# EAGLE design Spresense_PLC _Rev1-02 (EAGLE 9.6.2)
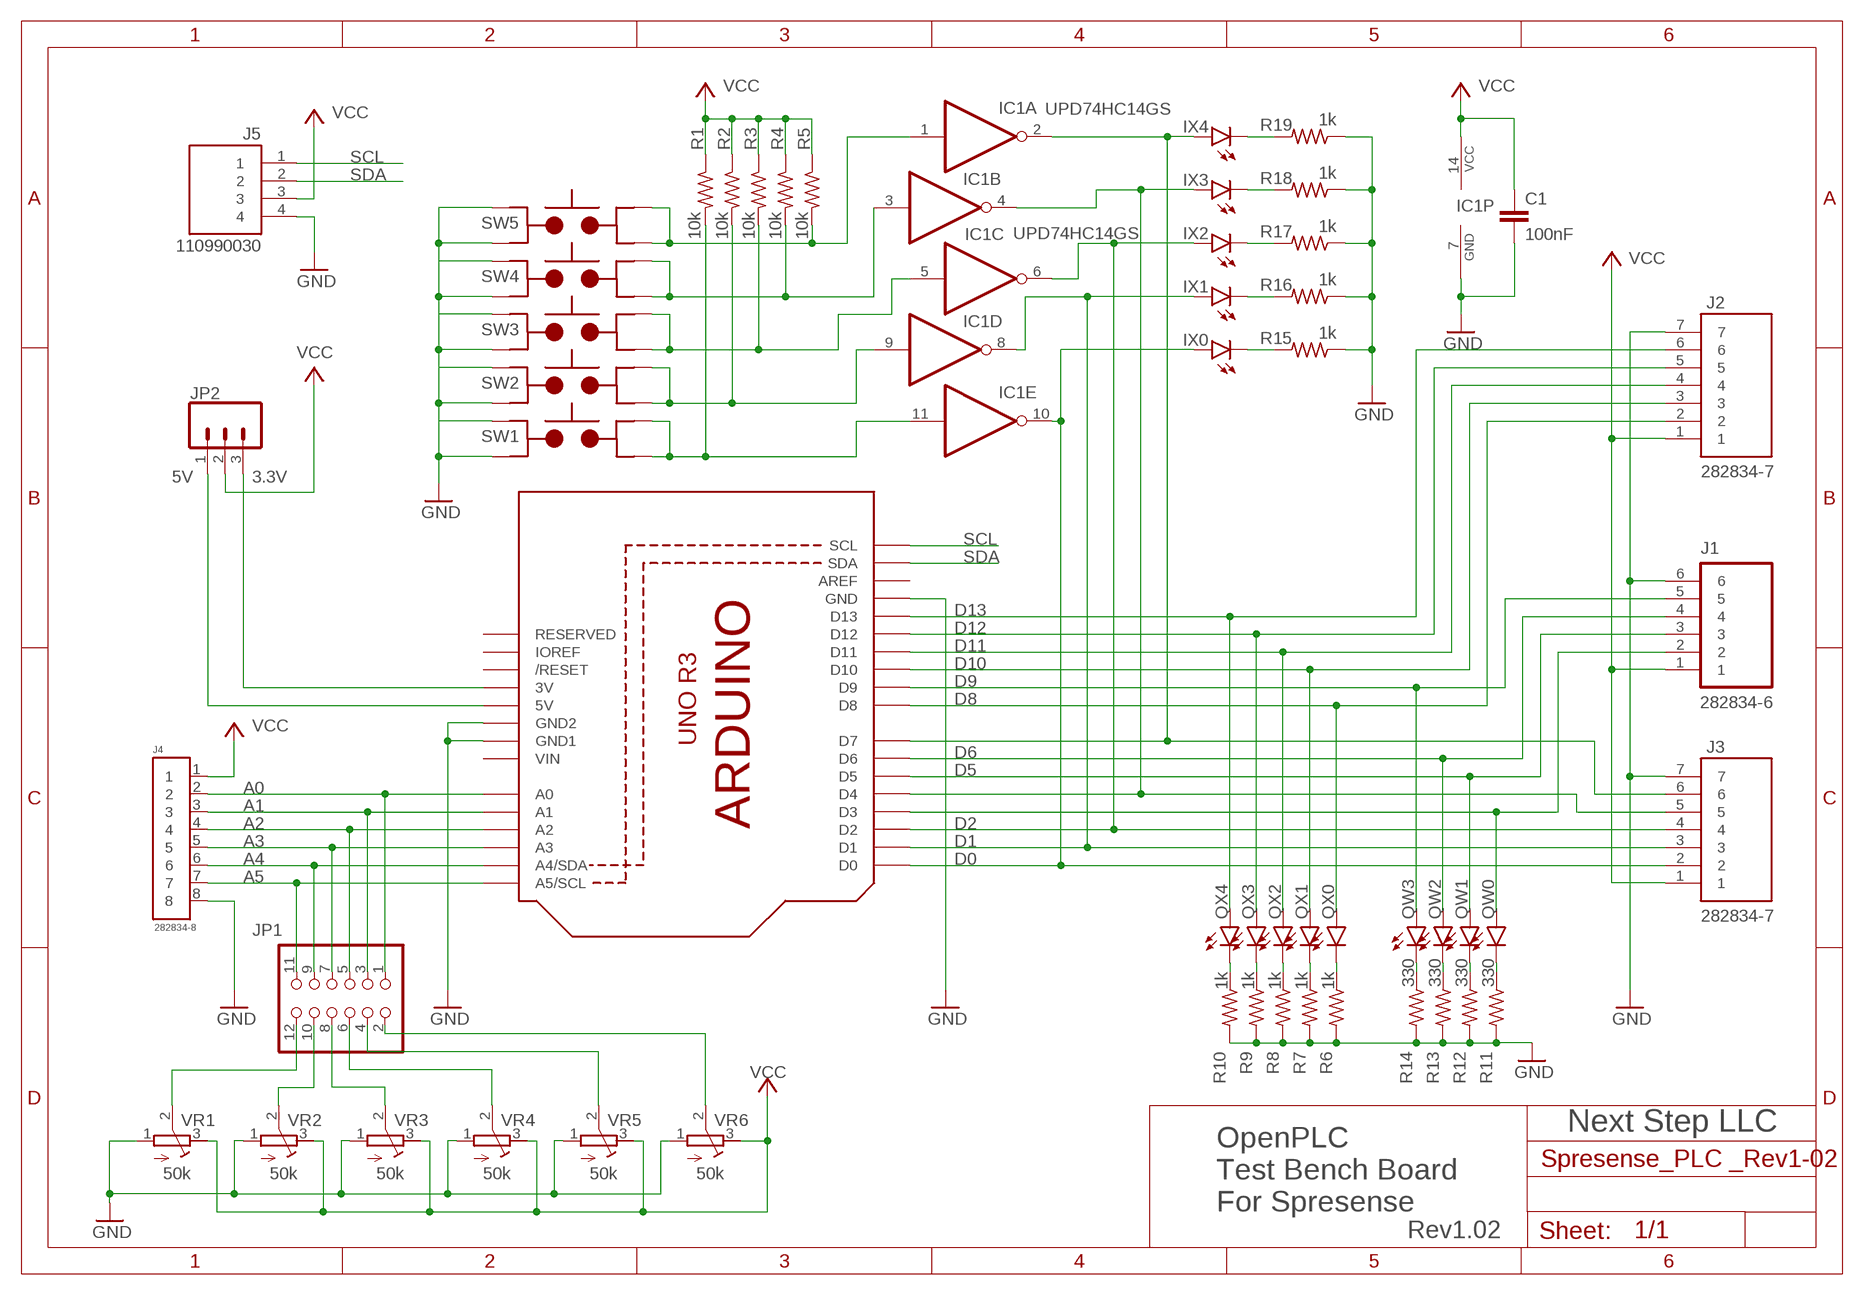
[diagram p0: schematic, sheet 1]

## Parts
C1  100nF  C-EUC0603  [C0603]
IC1  UPD74HC14GS  74ALS04D  [SO14]
IX0  LEDCHIP-LED0603  [CHIP-LED0603]
IX1  LEDCHIP-LED0603  [CHIP-LED0603]
IX2  LEDCHIP-LED0603  [CHIP-LED0603]
IX3  LEDCHIP-LED0603  [CHIP-LED0603]
IX4  LEDCHIP-LED0603  [CHIP-LED0603]
J1  282834-6  [TE_282834-6]
J2  282834-7  [TE_282834-7]
J3  282834-7  [TE_282834-7]
J4  282834-8  [HDRV8W85P254_8X1_2078X650X1000]
J5  110990030  [SEEED_110990030]
JP1  PINHD-2X6  [2X06]
JP2  455-1750-1-ND  CONN_03  [1X03]
QW0  LEDCHIP-LED0603  [CHIP-LED0603]
QW1  LEDCHIP-LED0603  [CHIP-LED0603]
QW2  LEDCHIP-LED0603  [CHIP-LED0603]
QW3  LEDCHIP-LED0603  [CHIP-LED0603]
QX0  LEDCHIP-LED0603  [CHIP-LED0603]
QX1  LEDCHIP-LED0603  [CHIP-LED0603]
QX2  LEDCHIP-LED0603  [CHIP-LED0603]
QX3  LEDCHIP-LED0603  [CHIP-LED0603]
QX4  LEDCHIP-LED0603  [CHIP-LED0603]
R1  10k  R-US_R0603  [R0603]
R2  10k  R-US_R0603  [R0603]
R3  10k  R-US_R0603  [R0603]
R4  10k  R-US_R0603  [R0603]
R5  10k  R-US_R0603  [R0603]
R6  1k  R-US_R0603  [R0603]
R7  1k  R-US_R0603  [R0603]
R8  1k  R-US_R0603  [R0603]
R9  1k  R-US_R0603  [R0603]
R10  1k  R-US_R0603  [R0603]
R11  330  R-US_R0603  [R0603]
R12  330  R-US_R0603  [R0603]
R13  330  R-US_R0603  [R0603]
R14  330  R-US_R0603  [R0603]
R15  1k  R-US_R0603  [R0603]
R16  1k  R-US_R0603  [R0603]
R17  1k  R-US_R0603  [R0603]
R18  1k  R-US_R0603  [R0603]
R19  1k  R-US_R0603  [R0603]
SW1  TL3342F160QG/TR  [SW_TL3342F160QG/TR]
SW2  TL3342F160QG/TR  [SW_TL3342F160QG/TR]
SW3  TL3342F160QG/TR  [SW_TL3342F160QG/TR]
SW4  TL3342F160QG/TR  [SW_TL3342F160QG/TR]
SW5  TL3342F160QG/TR  [SW_TL3342F160QG/TR]
U1  ARDUINOR3-DIMENSION  [ARDUINOR3]
VR1  50k  R-TRIMM3339P  [RTRIM3339P]
VR2  50k  R-TRIMM3339P  [RTRIM3339P]
VR3  50k  R-TRIMM3339P  [RTRIM3339P]
VR4  50k  R-TRIMM3339P  [RTRIM3339P]
VR5  50k  R-TRIMM3339P  [RTRIM3339P]
VR6  50k  R-TRIMM3339P  [RTRIM3339P]

## Nets
A0: J4.2 JP1.1 U1.A0
A1: J4.3 JP1.3 U1.A1
A2: J4.4 JP1.5 U1.A2
A3: J4.5 JP1.7 U1.A3
A4: J4.6 JP1.9 U1.A4(A4/SDA)
A5: J4.7 JP1.11 U1.A5(A5/SCL)
D0: IC1.10(E:O) IX0.A J3.2 U1.D0
D1: IC1.8(D:O) IX1.A J3.3 U1.D1
D2: IC1.6(C:O) IX2.A J3.4 U1.D2
D5: IC1.4(B:O) IX3.A J3.5 U1.D4
D6: IC1.2(A:O) IX4.A J3.6 U1.D7
D8: J2.2 QX0.A U1.D8
D9: J1.5 QW3.A U1.D9
D10: J2.3 QX1.A U1.D10
D11: J2.4 QX2.A U1.D11
D12: J2.5 QX3.A U1.D12
D13: J2.6 QX4.A U1.D13
GND: C1.2 IC1.7(P:GND) J1.6 J2.7 J3.7 J4.8 J5.4 R6.2 R7.2 R8.2 R9.2 R10.2 R11.2 R12.2 R13.2 R14.2 R15.1 R16.1 R17.1 R18.1 R19.1 SW1.3 SW1.4 SW2.3 SW2.4 SW3.3 SW3.4 SW4.3 SW4.4 SW5.3 SW5.4 U1.GND U1.GND1 U1.GND2 VR1.1(A) VR2.1(A) VR3.1(A) VR4.1(A) VR5.1(A) VR6.1(A)
N$1: QX3.C R9.1
N$2: QX2.C R8.1
N$3: QX1.C R7.1
N$4: QX0.C R6.1
N$5: QW2.C R13.1
N$6: QW1.C R12.1
N$7: QW0.C R11.1
N$8: JP1.12 VR1.2(S)
N$9: JP1.10 VR2.2(S)
N$10: JP1.8 VR3.2(S)
N$11: JP1.6 VR4.2(S)
N$12: JP1.4 VR5.2(S)
N$13: JP1.2 VR6.2(S)
N$14: JP2.3 U1.3V
N$15: J1.2 QW0.A U1.D3
N$16: JP2.1 U1.5V
N$17: IX4.C R19.2
N$18: IX3.C R18.2
N$19: IX2.C R17.2
N$20: IX1.C R16.2
N$21: IX0.C R15.2
N$22: J1.3 QW1.A U1.D5
N$23: J1.4 QW2.A U1.D6
N$25: QW3.C R14.1
N$26: QX4.C R10.1
N$27: IC1.11(E:I) R1.2 SW1.1 SW1.2
N$28: IC1.9(D:I) R2.2 SW2.1 SW2.2
N$29: IC1.5(C:I) R3.2 SW3.1 SW3.2
N$30: IC1.3(B:I) R4.2 SW4.1 SW4.2
N$31: IC1.1(A:I) R5.2 SW5.1 SW5.2
SCL: J5.1 U1.SCL
SDA: J5.2 U1.SDA
VCC: C1.1 IC1.14(P:VCC) J1.1 J2.1 J3.1 J4.1 J5.3 JP2.2 R1.1 R2.1 R3.1 R4.1 R5.1 VR1.3(E) VR2.3(E) VR3.3(E) VR4.3(E) VR5.3(E) VR6.3(E)
Unconnected: IC1.12(F:O) IC1.13(F:I) U1.AREF U1.IOREF U1.RESERVED U1.RESET(/RESET)

## Notes on the sheet
- 5V | 3.3V
- Next Step LLC
- OpenPLC
  Test Bench Board
  For Spresense
- Rev1.02

## Power pins joined to a net without a drawn wire
VIN: U1.VIN

## Library data of the parts
C1 = rcl:C-EU: CAPACITOR, European symbol; SPICEPREFIX: C
IC1 = 74xx-us:74*04: Hex INVERTER
IX0 IX1-IX4 QW0 QW1-QW3 QX0 QX1-QX4 = led:LED: LED OSRAM: - CHIPLED LG R971, LG N971, LY N971, LG Q971, LY Q971, LO R971, LY R971 LH N974, LH R974 LS Q976, LO Q976, LY Q976 LO Q996 - Hyper CHIPLED LW Q18S LB Q993, LB Q99A, LB R99A - SideLED LS A670, LO A670, LY A670, LG A670, LP A670 LB A673, LV A673, LT A673, LW A673 LH A674 LY A675 LS A676, LA A676, LO A676, LY A676, LW A676 LS A679, LY A679, LG A679 - Hyper Micro SIDELED® LS Y876, LA Y876, LO Y876, LY Y876 LT Y87S - SmartLED LW L88C, LW L88S LB L89C, LB L89S, LG L890 LS L89K, LO L89K, LY L89K LS L896, LA L896, LO L896, LY L896 - TOPLED LS T670, LO T670, LY T670, LG T670, LP T670 LSG T670, LSP T670, LSY T670, LOP T670, LYG T670 LG T671, LOG T671, LSG T671 LB T673, LV T673, LT T673, LW T673 LH T674 LS T676, LA T676, LO T676, LY T676, LB T676, LH T676, LSB T676, LW T676 LB T67C, LV T67C, LT T67C, LS T67K, LO T67K, LY T67K, LW E67C LS E67B, LA E67B, LO E67B, LY E67B, LB E67C, LV E67C, LT E67C LW T67C LS T679, LY T679, LG T679 LS T770, LO T770, LY T770, LG T770, LP T770 LB T773, LV T773, LT T773, LW T773 LH T774 LS E675, LA E675, LY E675, LS T675 LS T776, LA T776, LO T776, LY T776, LB T776 LHGB T686 LT T68C, LB T68C - Hyper Mini TOPLED® LB M676 - Mini TOPLED Santana® LG M470 LS M47K, LO M47K, LY M47K Source: http://www.osram.convergy.de LUXEON: - LUMILED® LXK2-PW12-R00, LXK2-PW12-S00, LXK2-PW14-U00, LXK2-PW14-V00 LXK2-PM12-R00, LXK2-PM12-S00, LXK2-PM14-U00 LXK2-PE12-Q00, LXK2-PE12-R00, LXK2-PE12-S00, LXK2-PE14-T00, LXK2-PE14-U00 LXK2-PB12-K00, LXK2-PB12-L00, LXK2-PB12-M00, LXK2-PB14-N00, LXK2-PB14-P00, LXK2-PB14-Q00 LXK2-PR12-L00, LXK2-PR12-M00, LXK2-PR14-Q00, LXK2-PR14-R00 LXK2-PD12-Q00, LXK2-PD12-R00, LXK2-PD12-S00 LXK2-PH12-R00, LXK2-PH12-S00 LXK2-PL12-P00, LXK2-PL12-Q00, LXK2-PL12-R00 Source: www.luxeon.com KINGBRIGHT: KA-3528ASYC Source: www.kingbright.com
J1 = 282834-6:282834-6: TERM BLOCK 6POS SIDE ENT 2.54MM Check availability <https://pricing.snapeda.com/parts/282834-6/TE%20Connectivity/view-part?ref=eda>; AVAILABILITY: In Stock; COMMENT: 282834-6; DESCRIPTION: Wire-To-Board Terminal Block, 6, 150 V, 10 A, 30 Awg, 16 Awg, 1.4 Mm; EU_ROHS_COMPLIANCE: Compliant with Exemptions; MF: TE Connectivity; MP: 282834-6; PACKAGE: None; PRICE: None; PURCHASE-URL: https://pricing.snapeda.com/search/part/282834-6/?ref=eda
J2 J3 = 282834-7:282834-7: Check availability <https://pricing.snapeda.com/parts/282834-7/TE%20Connectivity/view-part?ref=eda>; AVAILABILITY: In Stock; COMMENT: 282834-7; DESCRIPTION: TERMI-BLOK PCB MOUNT, 90 7P.; EU_ROHS_COMPLIANCE: Compliant with Exemptions; MF: TE Connectivity; MP: 282834-7; PACKAGE: None; PRICE: None; PURCHASE-URL: https://pricing.snapeda.com/search/part/282834-7/?ref=eda
J4 = 282834-8:282834-8: Screw terminal 1.4 mm² Number of pins 8 282834-8 TE Connectivity Green 1 pc(s) Check availability <https://pricing.snapeda.com/parts/282834-8/TE%20Connectivity/view-part?ref=eda>; AVAILABILITY: In Stock; COMMENT: 282834-8; DESCRIPTION: Buchanan; Conn; Term Blk; PCB; 8; 2.54mm; Front; 30-16 AWG; Green; 10 A; 150 V; EU_ROHS_COMPLIANCE: Compliant with Exemptions; MF: TE Connectivity; MP: 282834-8; PACKAGE: None; PRICE: None; PURCHASE-URL: https://pricing.snapeda.com/search/part/282834-8/?ref=eda
J5 = 110990030:110990030: Check prices <https://pricing.snapeda.com/parts/110990030/Seeed%20Technology%20Co.%2C%20Ltd/view-part?ref=eda>; AVAILABILITY: Good; DESCRIPTION: GROVE 2MM 4PIN VERT CONN 10PCS; MF: Seeed Technology Co., Ltd; MP: 110990030; PACKAGE: None; PRICE: None; PURCHASE-URL: https://pricing.snapeda.com/search/part/110990030/?ref=eda
JP1 = pinhead:PINHD-2X6: PIN HEADER
JP2 = SparkFun-Connectors:CONN_03: Multi connection point. Often used as Generic Header-pin footprint for 0.1 inch spaced/style header connections On any of the 0.1 inch spaced packages, you can populate with these: Break Away Headers - Straight <https://www.sparkfun.com/products/116> (PRT-00116) Break Away Male Headers - Right Angle <https://www.sparkfun.com/products/553> (PRT-00553) Female Headers <https://www.sparkfun.com/products/115> (PRT-00115) Break Away Headers - Machine Pin <https://www.sparkfun.com/products/117> (PRT-00117) Break Away Female Headers - Swiss Machine Pin <https://www.sparkfun.com/products/743> (PRT-00743) Stackable Header - 3 Pin (Female, 0.1") <https://www.sparkfun.com/products/13875> (PRT-13875) For SCREWTERMINALS and SPRING TERMINALS visit here: Screw Terimnals on SparkFun.com <https://www.sparkfun.com/search/results?term=Screw+Terminals> (5mm/3.5mm/2.54mm spacing) This device is also useful as a general connection point to wire up your design to another part of your project. Our various solder wires solder well into these plated through hole pads. Hook-Up Wire - Assortment (Stranded, 22 AWG) <https://www.sparkfun.com/products/11375> (PRT-11375) Hook-Up Wire - Assortment (Solid Core, 22 AWG) <https://www.sparkfun.com/products/11367> (PRT-11367) View the entire wire category on our website here <https://www.sparkfun.com/categories/141> Special notes: Molex polarized connector foot print use with SKU : PRT-08232 with associated crimp pins and housings.; PROD_ID: XXX-00000
R1-R19 = rcl:R-US_: RESISTOR, American symbol; SPICEPREFIX: R
SW1-SW5 = TL3342F160QG_TR:TL3342F160QG/TR: TL3342 Series SPST 1.6 N Round Button Gull Wing Surface Mount Tactile Switch Check availability <https://pricing.snapeda.com/parts/TL3342F160QG/TR/E-Switch/view-part?ref=eda>; AVAILABILITY: In Stock; DESCRIPTION: Tactile Switch SPST-NO Top Actuated Surface Mount; MF: E-Switch; MP: TL3342F160QG/TR; PACKAGE: None; PRICE: None; PURCHASE-URL: https://pricing.snapeda.com/search/part/TL3342F160QG/TR/?ref=eda
U1 = adafruit:ARDUINOR3: This is a new object for the new Arduino R3 - with extra pins that you may want to use (such as IOref, and duplicated A4/A5
VR1-VR6 = rcl:R-TRIMM: Trimm resistor; SPICEMODEL: X; SPICEPREFIXL: POT

## Board
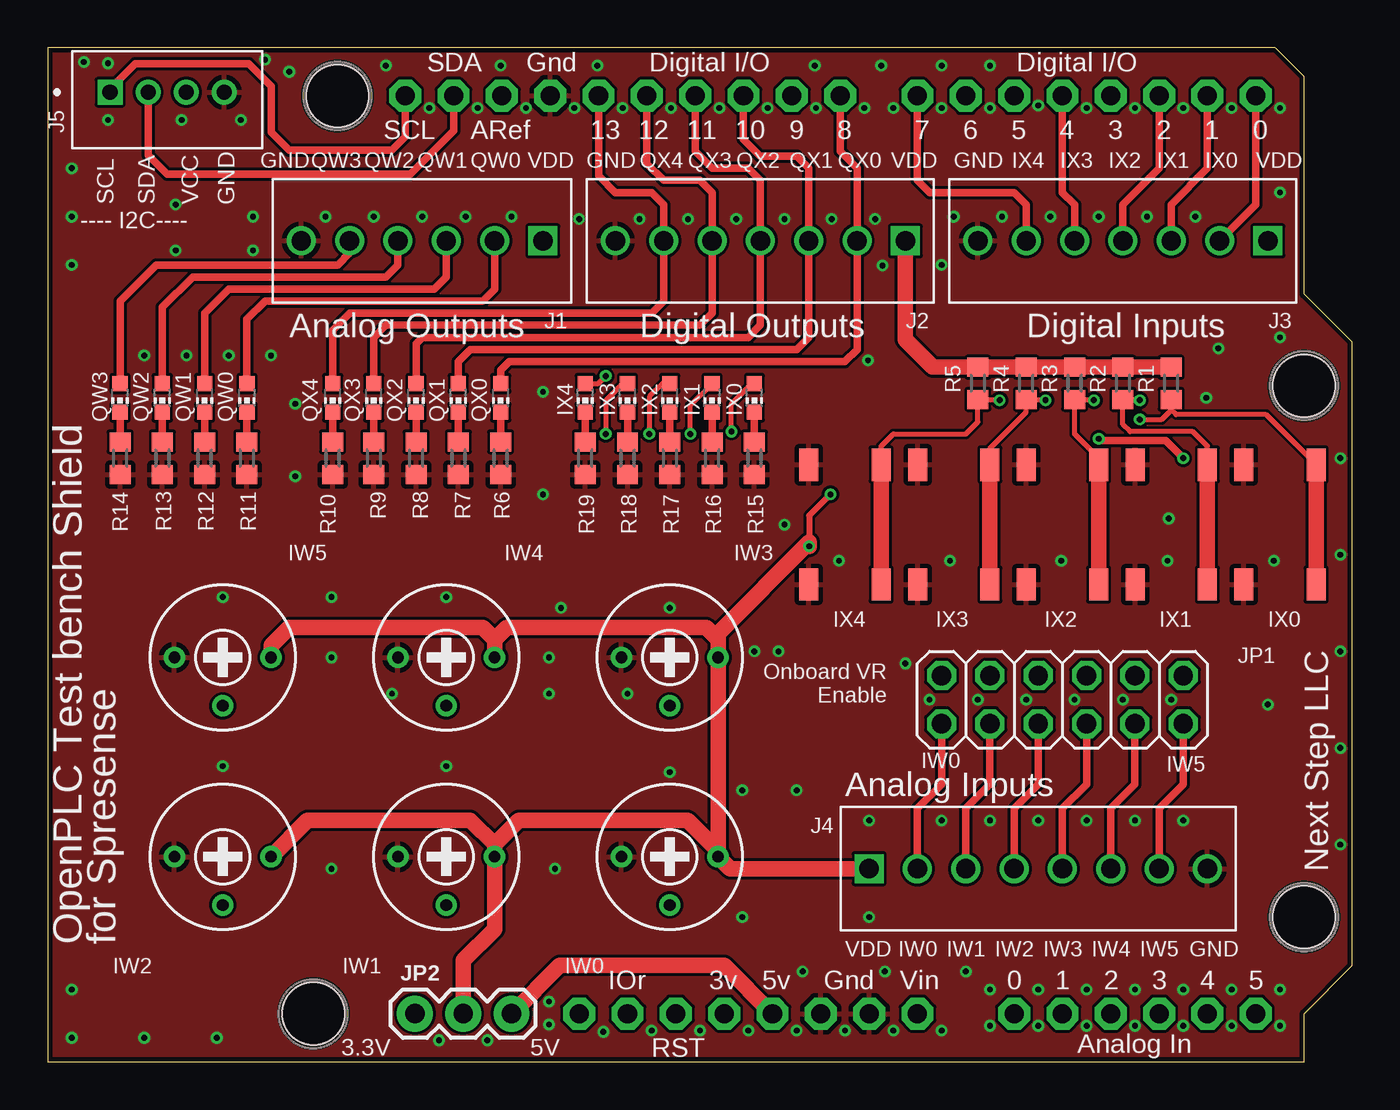
[diagram p1: board, top side]
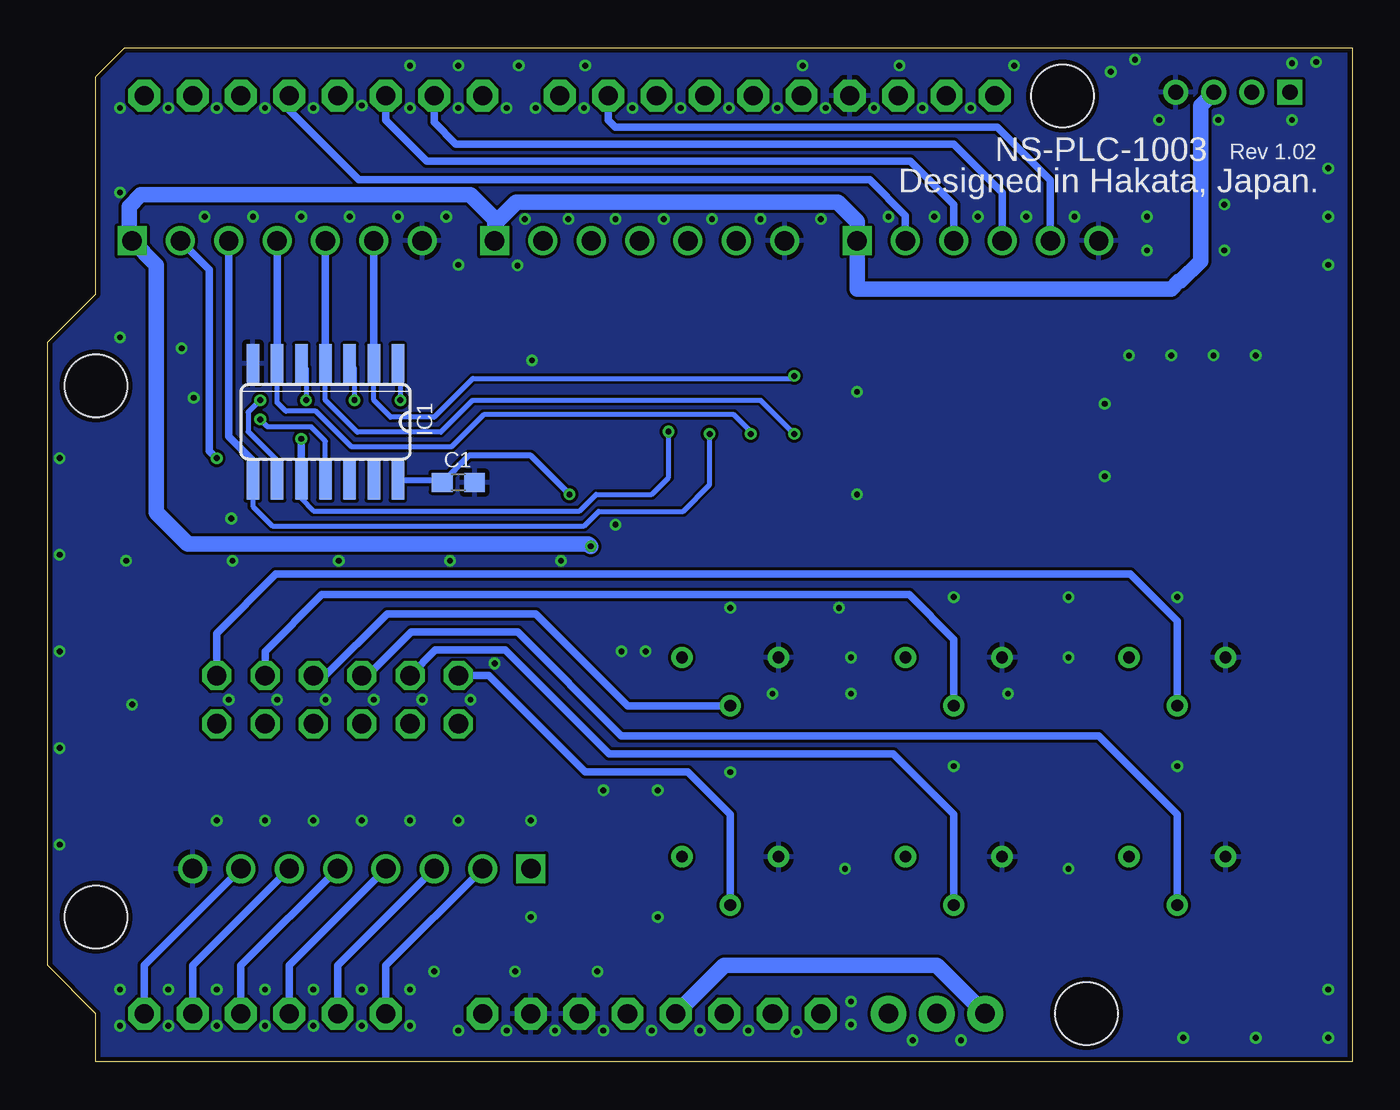
[diagram p2: board, bottom side, seen from below]

Size 68.58 x 53.34 mm. Coordinates in mm from the lower left corner, seen from the top.
Copper layers (1*16): Top 0.035mm / dielectric 1.5mm / Bottom 0.035mm
Design rules "SeeedStudio_2layer_DRU_no_angle_20140221": minimum track width 6mil, minimum drill 12mil, track to track 6mil, track to pad 6mil, pad to pad 6mil, via to via 6mil, smd to smd 0mil, copper to edge 10mil, drill to drill 10mil, minimum pad ring 10mil, minimum via ring 6mil, stop-mask expansion 2mil, vias tented up to drill 100mil, thermal gap 10mil
Holes 3.3 mm at 15.24,50.8 13.97,2.54 66.04,7.62 66.04,35.56

### Footprints (pad centres in the part's own frame; a part is rotated, then mirrored left to right if it is on the bottom)
C0603 = smd 1.1 x 1: 1 -0.85,0; 2 0.85,0
SO14 = smd 0.66 x 2.032: 1 -3.81,-3.073; 2 -2.54,-3.073; 3 -1.27,-3.073; 4 0,-3.073; 5 1.27,-3.073; 6 2.54,-3.073; 7 3.81,-3.073; 8 3.81,3.073; 9 2.54,3.073; 10 1.27,3.073; 11 0,3.073; 12 -1.27,3.073; 13 -2.54,3.073; 14 -3.81,3.073
CHIP-LED0603 = smd 0.8 x 0.8: A 0,-0.75; C 0,0.75
TE_282834-6 = drill 1.016 square: 1 -6.35,0 | drill 1.016: 2 -3.81,0; 3 -1.27,0; 4 1.27,0; 5 3.81,0; 6 6.35,0
TE_282834-7 = drill 1.016 square: 1 -7.62,0 | drill 1.016: 2 -5.08,0; 3 -2.54,0; 4 0,0; 5 2.54,0; 6 5.08,0; 7 7.62,0
HDRV8W85P254_8X1_2078X650X1000 = drill 1.016 square: 1 0,0 | drill 1.016: 2 2.54,0; 3 5.08,0; 4 7.62,0; 5 10.16,0; 6 12.7,0; 7 15.24,0; 8 17.78,0
SEEED_110990030 = drill 0.8 square: 1 -3,0 | drill 0.8: 2 -1,0; 3 1,0; 4 3,0
2X06 = drill 1.016 octagon: 1 -6.35,-1.27; 2 -6.35,1.27; 3 -3.81,-1.27; 4 -3.81,1.27; 5 -1.27,-1.27; 6 -1.27,1.27; 7 1.27,-1.27; 8 1.27,1.27; 9 3.81,-1.27; 10 3.81,1.27; 11 6.35,-1.27; 12 6.35,1.27
1X03 = drill 1.016 pad 1.88: 1 0,0; 2 2.54,0; 3 5.08,0
R0603 = smd 1 x 1.1: 1 -0.85,0; 2 0.85,0
SW_TL3342F160QG/TR = smd 1.7 x 1: 1 -3.15,-1.9; 2 3.15,-1.9; 3 -3.15,1.9; 4 3.15,1.9
ARDUINOR3 = drill 1 pad 1.676 octagon: 3V 35.56,2.54; 5V 38.1,2.54; A0 50.8,2.54; A1 53.34,2.54; A2 55.88,2.54; A3 58.42,2.54; A4 60.96,2.54; A5 63.5,2.54; AREF 23.876,50.8; D0 63.5,50.8; D1 60.96,50.8; D2 58.42,50.8; D3 55.88,50.8; D4 53.34,50.8; D5 50.8,50.8; D6 48.26,50.8; D7 45.72,50.8; D8 41.656,50.8; D9 39.116,50.8; D10 36.576,50.8; D11 34.036,50.8; D12 31.496,50.8; D13 28.956,50.8; GND 26.416,50.8; GND1 43.18,2.54; GND2 40.64,2.54; IOREF 30.48,2.54; RESERVED 27.94,2.54; RESET 33.02,2.54; SCL 18.796,50.8; SDA 21.336,50.8; VIN 45.72,2.54
RTRIM3339P = drill 0.61: 1 -2.54,0; 2 0,-2.54; 3 2.54,0

### Placement (x,y rotation side)
C1  46.99,30.48 0 bottom
IC1  53.98,33.66 180 bottom
IX0  37.15,34.92 180 top
IX1  34.92,34.92 180 top
IX2  32.7,34.92 180 top
IX3  30.48,34.92 180 top
IX4  28.26,34.92 180 top
J1  19.68,43.18 180 top
J2  37.47,43.18 180 top
J3  56.52,43.18 180 top
J4  43.18,10.16 0 top
J5  6.29,50.99 0 top
JP1  53.34,19.05 0 top
JP2  24.38,2.54 180 top
QW0  10.48,34.92 180 top
QW1  8.26,34.92 180 top
QW2  6.03,34.92 180 top
QW3  3.81,34.92 180 top
QX0  23.81,34.92 180 top
QX1  21.59,34.92 180 top
QX2  19.37,34.92 180 top
QX3  17.14,34.92 180 top
QX4  14.99,34.92 180 top
R1  59.05,35.69 270 top
R2  56.52,35.69 270 top
R3  53.98,35.69 270 top
R4  51.44,35.69 270 top
R5  48.9,35.69 270 top
R6  23.81,31.75 270 top
R7  21.59,31.75 270 top
R8  19.37,31.75 270 top
R9  17.14,31.75 270 top
R10  14.99,31.75 270 top
R11  10.48,31.75 270 top
R12  8.26,31.75 270 top
R13  6.03,31.75 270 top
R14  3.81,31.75 270 top
R15  37.15,31.75 90 top
R16  34.92,31.75 90 top
R17  32.7,31.75 90 top
R18  30.48,31.75 90 top
R19  28.26,31.75 90 top
SW1  64.77,28.26 90 top
SW2  59.05,28.26 90 top
SW3  53.34,28.26 90 top
SW4  47.62,28.26 90 top
SW5  41.91,28.26 90 top
U1  0,0 0 top
VR1  9.21,21.27 0 top
VR2  20.95,21.27 0 top
VR3  32.7,21.27 0 top
VR4  9.21,10.79 0 top
VR5  20.95,10.79 0 top
VR6  32.7,10.79 0 top

### Tracks (layer width: path | path; a pad name or v marks a point on that pad's centre or on a via)
A0
  Top 0.406: JP1.1 46.99,14.61 45.72,13.34 J4.2
  Bottom 0.406: J4.2 50.8,5.08 U1.A0
A1
  Top 0.406: JP1.3 49.53,14.61 48.26,13.34 J4.3
  Bottom 0.406: J4.3 53.34,5.08 U1.A1
A2
  Top 0.406: JP1.5 52.07,14.61 50.8,13.34 J4.4
  Bottom 0.406: J4.4 55.88,5.08 U1.A2
A3
  Top 0.406: JP1.7 54.61,14.61 53.34,13.34 J4.5
  Bottom 0.406: J4.5 58.42,5.08 U1.A3
A4
  Top 0.406: JP1.9 57.15,14.61 55.88,13.34 J4.6
  Bottom 0.406: J4.6 60.96,5.08 U1.A4
A5
  Top 0.406: JP1.11 59.69,14.61 58.42,13.34 J4.7
  Bottom 0.406: J4.7 63.5,5.08 U1.A5
D0  (via drill 0.3)
  Top 0.254: v35.94,33.15 35.94,34.6 37.02,35.67 IX0.A
  Top 0.406: J3.2 63.5,45.09 U1.D0 | v55.24,32.77 55.35,32.66 58.78,32.66 v59.69,31.75
  Bottom 0.254: IC1.10 55.24,29.62 54.61,28.98 40.62,28.98 39.75,29.84 36.83,29.84 35.94,30.73 v35.94,33.15
  Bottom 0.406: IC1.10 v55.24,32.77 | v59.69,31.75 60.07,32.13 60.07,41.66 J3.2
D1  (via drill 0.3)
  Top 0.254: v33.78,33.02 33.78,34.53 IX1.A
  Top 0.406: J3.3 59.05,45.09 60.96,46.99 U1.D1
  Bottom 0.254: IC1.8 57.78,29.21 56.77,28.19 40.39,28.19 39.62,28.96 35.18,28.96 33.78,30.35 v33.78,33.02
  Bottom 0.406: IC1.8 57.78,31.62 59.05,32.89 J3.3
D2  (via drill 0.3)
  Top 0.254: IX2.A 32.32,35.67 31.62,34.98 v31.62,33.02
  Top 0.406: J3.4 56.52,45.09 58.42,46.99 U1.D2
  Bottom 0.254: v31.62,33.02 31.62,33.15 32.51,34.04 45.65,34.04 47.35,32.33 52.59,32.33 54.47,34.21 56.06,34.21 56.52,34.67 IC1.6
  Bottom 0.406: IC1.6 J3.4
D5  (via drill 0.3)
  Top 0.254: IX3.A 30.23,35.67 29.34,34.79 v29.34,33.02
  Top 0.406: J3.5 53.98,45.09 53.34,45.72 U1.D4
  Bottom 0.254: v29.34,33.02 31.11,34.8 46.23,34.8 47.9,33.12 52.3,33.12 53.98,34.8 IC1.4
  Bottom 0.406: IC1.4 J3.5
D6  (via drill 0.3)
  Top 0.254: IX4.A 28.94,35.67 v29.34,36.07
  Top 0.406: J3.6 51.44,45.09 50.8,45.72 46.35,45.72 45.72,46.35 U1.D7
  Bottom 0.254: v29.34,36.07 29.46,35.94 46.23,35.94 48.26,33.91 50.55,33.91 51.44,34.8 IC1.2
  Bottom 0.406: IC1.2 J3.6
D8
  Top 0.406: U1.D8 41.66,47.88 42.55,46.99 J2.2 42.55,37.47 41.91,36.83 24.26,36.83 23.81,36.39 QX0.A
D9
  Top 0.406: QW3.A 3.81,40.01 5.71,41.91 15.24,41.91 15.88,42.55 J1.5
  Bottom 0.406: J1.5 15.88,46.35 18.67,49.15 38.73,49.15 39.12,49.53 U1.D9
D10
  Top 0.406: U1.D10 36.58,48.51 37.47,47.62 39.37,47.62 40.01,46.99 J2.3 40.01,38.1 39.37,37.47 22.23,37.47 21.59,36.83 QX1.A
D11
  Top 0.406: U1.D11 34.04,47.88 34.92,46.99 36.83,46.99 37.47,46.35 J2.4 37.47,38.73 36.83,38.1 19.68,38.1 19.37,37.78 QX2.A
D12
  Top 0.406: U1.D12 31.5,47.24 32.38,46.35 34.29,46.35 34.92,45.72 J2.5 34.92,39.37 34.29,38.73 17.78,38.73 17.14,38.1 QX3.A
D13
  Top 0.406: U1.D13 28.96,46.61 29.84,45.72 31.75,45.72 32.38,45.09 J2.6 32.38,40.01 31.75,39.37 15.88,39.37 14.99,38.48 QX4.A
GND  (via drill 0.3)
  other vias: 12.7,52.07 11.43,52.7 3.17,52.51 1.91,52.58 1.27,46.99 1.27,44.45 1.27,41.91 1.27,3.81 1.27,1.27 5.08,1.27 8.89,1.27 20.57,1.14 23.11,1.14 26.35,1.97 29.21,1.59 31.75,1.65 34.29,1.65 36.83,1.65 39.37,1.65 41.91,1.65 44.45,1.65 46.99,1.65 39.69,4.76 44.01,4.76 48.26,4.76 49.53,3.81 49.53,1.91 52.07,3.81 52.07,1.91 54.61,1.91 54.61,3.81 57.15,1.91 57.15,3.81 59.69,3.81 59.69,1.91 62.23,3.81 62.23,1.91 64.77,3.81 64.77,1.91 39.37,14.29 43.18,12.7 46.99,12.7 49.53,12.7 52.07,12.7 54.61,12.7 57.15,12.7 59.69,12.7 67.94,11.43 67.94,16.51 67.94,21.59 67.94,26.67 67.94,31.75 64.77,38.1 64.77,45.72 64.77,50.16 62.23,50.16 59.69,50.16 57.15,50.16 54.61,50.16 52.07,50.29 49.53,50.16 46.99,50.16 44.45,50.16 42.93,50.16 40.39,50.16 37.85,50.16 35.31,50.16 32.77,50.16 30.23,50.16 27.69,50.16 25.15,50.16 22.61,50.16 20.07,50.16 6.73,45.09 10.79,44.45 14.61,44.45 17.14,44.45 19.68,44.45 21.97,44.45 24.38,44.45 27.94,44.32 31.11,44.32 33.66,44.32 36.2,44.32 38.73,44.32 43.5,44.32 47.62,44.45 50.16,44.45 52.7,44.45 55.24,44.45 57.78,44.45 60.33,44.45 46.99,41.91 10.79,42.67 6.73,42.67 64.14,18.8 38.42,21.59 30.48,19.37 18.1,19.37 26.35,3.17 43.88,41.88 41.21,44.32 64.45,26.35 58.86,26.35 53.28,26.35 47.43,26.35 41.59,26.35 43.12,36.89 26.04,29.84 13.02,30.8 10.16,49.53 7.05,49.53 3.17,49.53 49.53,52.39 46.99,52.39 43.81,52.39 40.32,52.39 28.89,52.39 23.81,52.39 17.78,52.39 36.51,7.62 36.51,14.29 26.35,19.37 37.15,21.59 5.08,37.15 7.3,37.15 9.53,37.15 11.75,37.15 13.02,34.61 26.04,35.24 38.73,28.26 9.21,24.45 14.92,24.45 14.92,21.27 20.95,24.45 26.99,23.88 26.35,21.27 32.7,23.88 9.21,15.56 20.95,15.56 32.7,15.24 14.92,10.16 26.67,10.16 43.18,7.62 61.53,37.53 60.9,34.92 46.35,19.05 48.9,19.05 51.44,19.05 53.98,19.05 56.52,19.05 59.05,19.05 58.93,28.57 45.09,20.95
  pour Top: 0,53.34 64.64,53.34 66.04,51.94 66.04,40.26 68.45,37.85 68.58,37.85 68.58,5.08 66.17,2.67 66.17,2.41 66.04,2.29 66.04,0 0,0
  pour Bottom: 0,53.34 64.77,53.34 66.04,52.07 66.04,40.64 68.58,38.1 68.58,5.08 66.04,2.54 66.04,0 0,0
N$1
  Top 0.406: R9.1 QX3.C
N$2
  Top 0.406: QX2.C R8.1
N$3
  Top 0.406: QX1.C R7.1
N$4
  Top 0.406: QX0.C R6.1
N$5
  Top 0.406: QW2.C R13.1
N$6
  Top 0.406: QW1.C R12.1
N$7
  Top 0.406: QW0.C R11.1
N$8
  Bottom 0.406: JP1.12 59.69,22.54 56.58,25.65 11.68,25.65 9.21,23.18 VR1.2
N$9
  Bottom 0.406: JP1.10 57.15,21.59 54.17,24.57 23.3,24.57 20.95,22.23 VR2.2
N$10
  Bottom 0.406: JP1.8 53.98,20.32 50.74,23.56 42.93,23.56 38.1,18.73 VR3.2
N$11
  Bottom 0.406: JP1.6 51.75,20.32 49.47,22.61 43.88,22.61 38.42,17.14 13.34,17.14 9.21,13.02 VR4.2
N$12
  Bottom 0.406: JP1.4 48.2,21.65 44.51,21.65 39.05,16.19 24.13,16.19 20.95,13.02 VR5.2
N$13
  Bottom 0.406: JP1.2 45.4,20.32 40.32,15.24 34.92,15.24 32.7,13.02 VR6.2
N$14
  Bottom 0.813: U1.3V 33.02,5.08 21.84,5.08 JP2.3
N$15
  Top 0.406: QW0.A 10.48,39.05 11.43,40.01 22.86,40.01 23.5,40.64 J1.2
  Bottom 0.406: U1.D3 55.88,50.04 52.22,46.38 25.38,46.38 23.5,44.49 J1.2
N$16
  Top 0.813: U1.5V 35.56,5.08 26.92,5.08 JP2.1
N$17
  Top 0.406: IX4.C R19.2
N$18
  Top 0.406: IX3.C R18.2
N$19
  Top 0.406: IX2.C R17.2
N$20
  Top 0.406: IX1.C R16.2
N$21
  Top 0.406: IX0.C R15.2
N$22
  Top 0.406: QW1.A 8.26,39.37 9.53,40.64 20.32,40.64 20.95,41.27 J1.3
  Bottom 0.406: J1.3 20.95,45.09 23.24,47.37 48.64,47.37 50.8,49.53 U1.D5
N$23
  Top 0.406: QW2.A 6.03,39.69 7.62,41.27 17.78,41.27 18.41,41.91 J1.4
  Bottom 0.406: J1.4 18.41,45.72 20.95,48.26 47.12,48.26 48.26,49.4 U1.D6
N$25
  Top 0.406: QW3.C R14.1
N$26
  Top 0.406: QX4.C R10.1
N$27  (via drill 0.3)
  Top 0.254: SW1.2 64.04,34.04 59.31,34.04 59.05,34.29 | v57.4,33.78 58.55,33.78 59.05,34.29 | 59.05,34.29 R1.2
  Top 0.813: SW1.2 SW1.1
  Bottom 0.254: IC1.11 53.98,32.64 54.74,33.4 57.02,33.4 v57.4,33.78
N$28  (via drill 0.3)
  Top 0.254: SW2.2 60.95,32.39 60.2,33.15 56.9,33.15 56.52,33.53 56.52,34.8 | 56.52,34.8 R2.2 | v57.4,34.8 56.52,34.8
  Top 0.813: SW2.2 SW2.1
  Bottom 0.254: IC1.9 56.52,31.62 58.04,33.15 58.04,34.16 v57.4,34.8
N$29  (via drill 0.3)
  Top 0.254: SW3.2 55.24,31.75 53.98,33.02 R3.2 54.01,34.8 v54.99,34.8
  Top 0.813: SW3.2 SW3.1
  Bottom 0.254: IC1.5 54.99,36.47 v54.99,34.8
N$30  (via drill 0.3)
  Top 0.254: SW4.2 49.52,32.25 51.44,34.16 R4.2 51.47,34.8 v52.45,34.8
  Top 0.813: SW4.2 SW4.1
  Bottom 0.254: IC1.3 52.45,36.47 v52.45,34.8
N$31  (via drill 0.3)
  Top 0.254: SW5.2 43.81,32.38 44.45,33.02 48.26,33.02 48.9,33.66 R5.2 48.93,34.8 v50.04,34.8
  Top 0.813: SW5.2 SW5.1
  Bottom 0.254: IC1.1 50.04,36.6 v50.04,34.8
SCL
  Top 0.406: J5.1 3.29,51.17 4.61,52.49 10.57,52.49 11.75,51.31 11.75,48.9 12.7,47.94 18.1,47.94 18.8,48.64 U1.SCL
SDA
  Top 0.406: J5.2 5.29,47.69 6.3,46.67 19.05,46.67 21.34,48.96 U1.SDA
VCC  (via drill 0.3)
  Top 0.305: v41.15,29.84 40.03,28.73 40.03,27.33
  Top 0.813: VR6.3 35.88,10.16 J4.1 | VR4.3 13.65,12.7 22.23,12.7 23.5,11.43 | 23.5,11.43 VR5.3 23.5,6.99 21.84,5.33 JP2.2 | 23.5,11.43 24.77,12.7 33.66,12.7 35.24,11.11 VR6.3 | 35.24,22.23 35.24,22.54 40.03,27.33 v40.03,27.11 | 35.24,22.23 VR3.3 VR6.3 | VR1.3 11.75,21.91 12.7,22.86 22.86,22.86 23.5,22.23 | VR2.3 23.5,22.23 | 23.5,22.23 24.13,22.86 34.61,22.86 35.24,22.23 | R1.1 R2.1 R3.1 R4.1 R5.1 46.52,36.54 45.09,37.97 J2.1
  Bottom 0.305: IC1.14 47.94,30.58 C1.1 46.44,31.88 43.18,31.88 v41.15,29.84
  Bottom 0.813: v40.03,27.11 40.16,27.24 61.21,27.24 62.87,28.89 62.87,41.91 J3.1 64.29,43.33 64.29,44.98 63.68,45.59 46.35,45.59 45.09,44.32 J2.1 45.09,44.08 43.96,45.21 27.05,45.21 26.04,44.2 J1.1 26.04,40.64 9.53,40.64 9.12,41.05 9.04,41.05 7.99,42.1 7.99,50.29 J5.3

### Text on the board
tPlace: GND | QW3 | QW2 | QW1 | QW0 | VDD | GND | QX4 | QX3 | QX2 | QX1 | QX0 | VDD | GND | IX4 | IX3 | IX2 | IX1 | IX0 | VDD | SCL | SDA | VCC | GND | ---- I2C---- | Analog Outputs | Digital Outputs | Digital Inputs | QW2 | QW1 | QW0 | QX3 | QX2 | QX1 | QX0 | IW5 | IW4 | IW3 | IX4 | IX3 | IX2 | IX1 | IX0 | Onboard VR / Enable | IW0 | IW5 | Analog Inputs | Next Step LLC | OpenPLC Test bench Shield | for Spresense | VDD | IW0 | IW1 | IW2 | IW3 | IW4 | IW5 | GND | IW2 | IW1 | IW0 | 3.3V | 5V
bPlace: NS-PLC-1003 | Designed in Hakata, Japan. | Rev 1.02